# EAGLE design bristol_longshot (EAGLE 7.3.0)
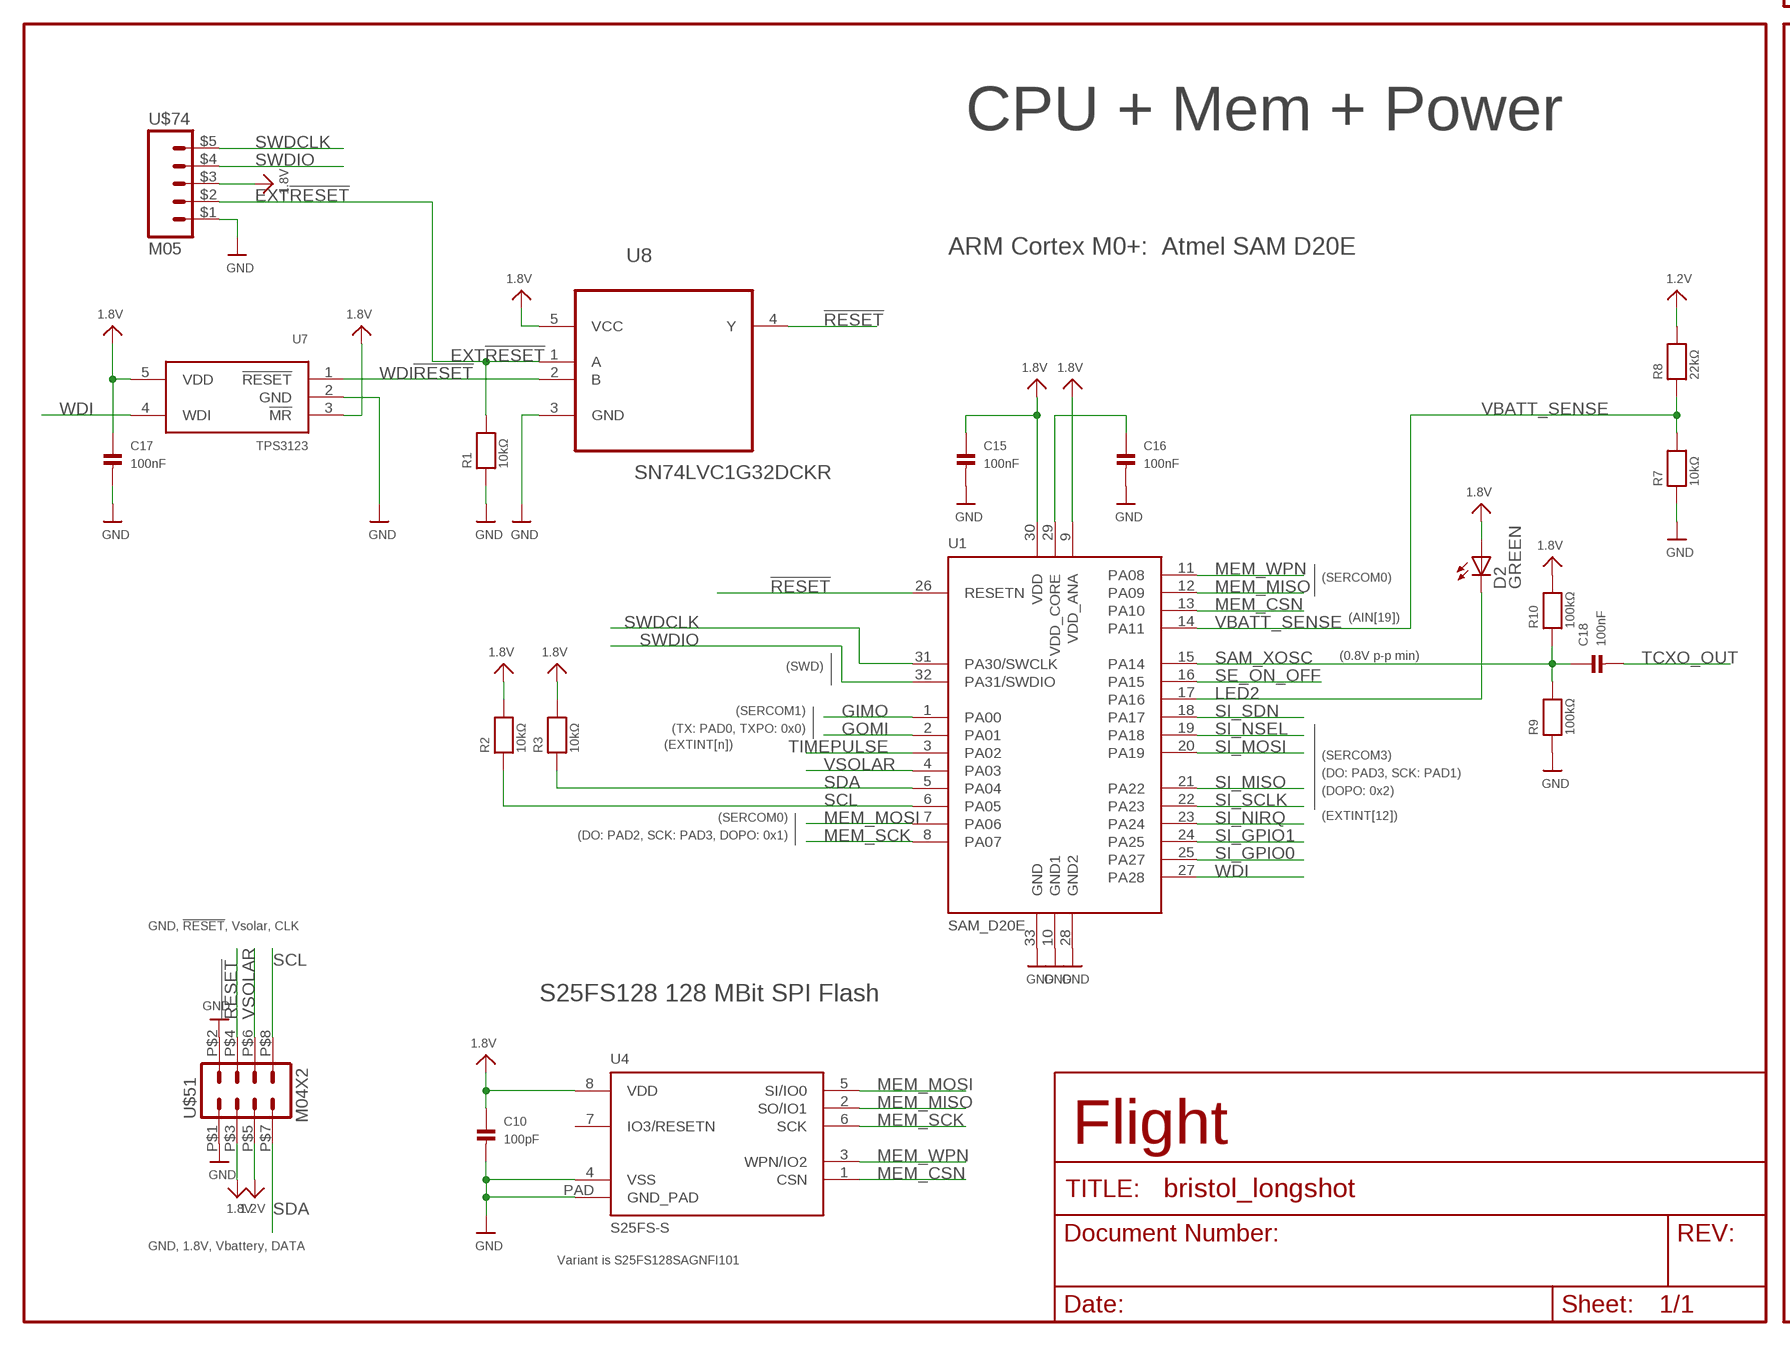
[diagram p0: schematic, sheet 1, part 1 of 2]
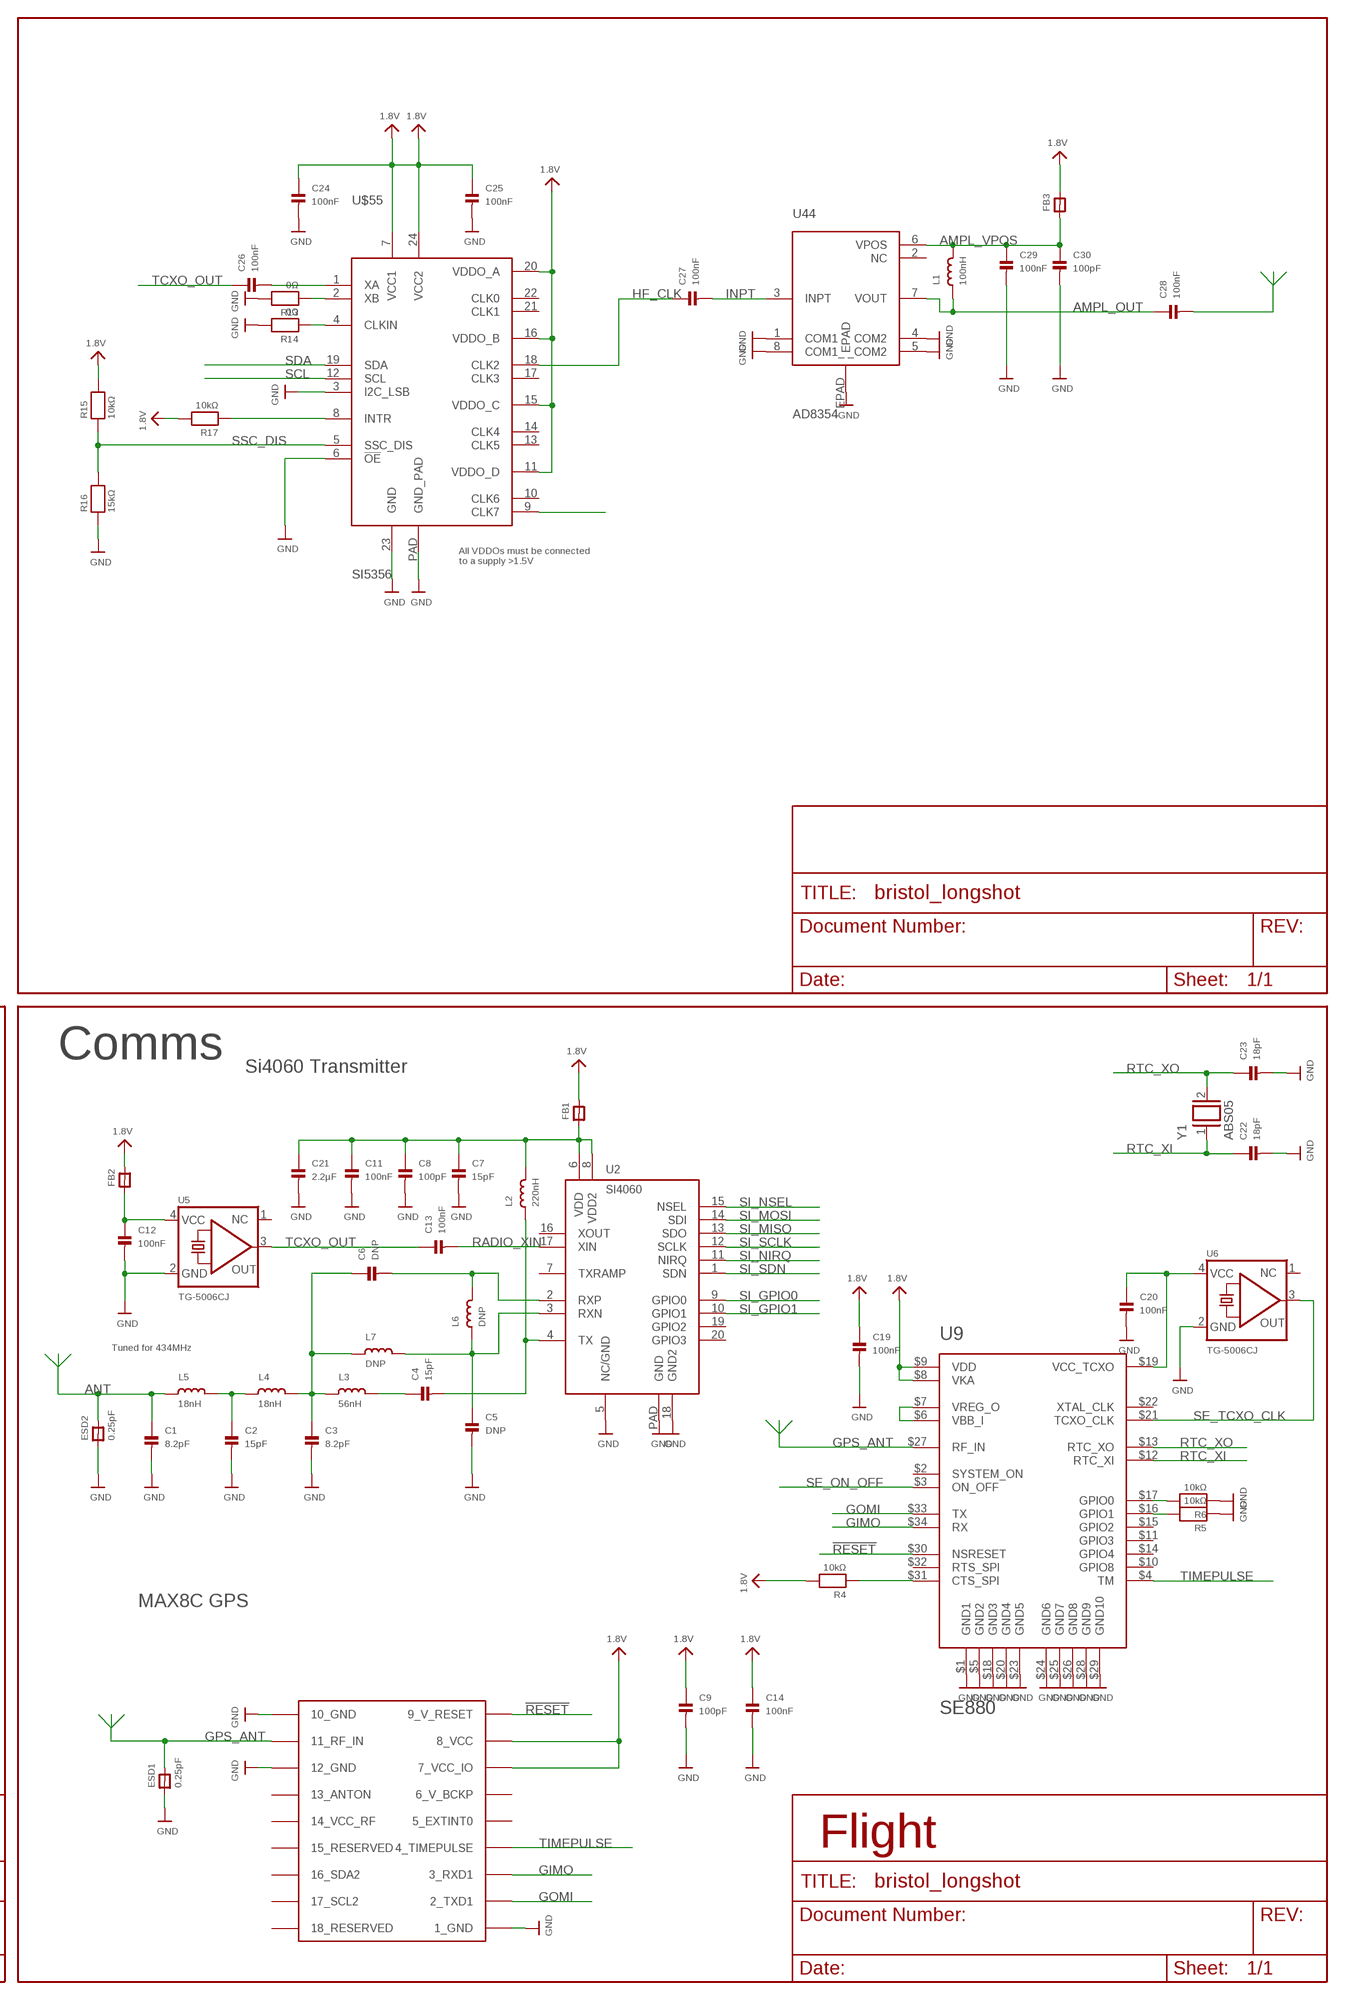
[diagram p1: schematic, sheet 1, part 2 of 2]

## Parts
C1  8.2pF  CAP_CERAMIC_0402  [_0402]
C2  15pF  CAP_CERAMIC_0402  [_0402]
C3  8.2pF  CAP_CERAMIC_0402  [_0402]
C4  15pF  CAP_CERAMIC_0402  [_0402]
C5  DNP  CAP_CERAMIC_0402  [_0402]
C6  DNP  CAP_CERAMIC_0402  [_0402]
C7  15pF  CAP_CERAMIC_0402  [_0402]
C8  100pF  CAP_CERAMIC_0402  [_0402]
C9  100pF  CAP_CERAMIC_0402  [_0402]
C10  100pF  CAP_CERAMIC_0402  [_0402]
C11  100nF  CAP_CERAMIC_0402  [_0402]
C12  100nF  CAP_CERAMIC_0402  [_0402]
C13  100nF  CAP_CERAMIC_0402  [_0402]
C14  100nF  CAP_CERAMIC_0402  [_0402]
C15  100nF  CAP_CERAMIC_0402  [_0402]
C16  100nF  CAP_CERAMIC_0402  [_0402]
C17  100nF  CAP_CERAMIC_0402  [_0402]
C18  100nF  CAP_CERAMIC_0402  [_0402]
C19  100nF  CAP_CERAMIC_0402  [_0402]
C20  100nF  CAP_CERAMIC_0402  [_0402]
C21  2.2µF  CAP_CERAMIC_0402  [_0402]
C22  18pF  CAP_CERAMIC_0402  [_0402]
C23  18pF  CAP_CERAMIC_0402  [_0402]
C24  100nF  CAP_CERAMIC_0402  [_0402]
C25  100nF  CAP_CERAMIC_0402  [_0402]
C26  100nF  CAP_CERAMIC_0402  [_0402]
C27  100nF  CAP_CERAMIC_0402  [_0402]
C28  100nF  CAP_CERAMIC_0402  [_0402]
C29  100nF  CAP_CERAMIC_0402  [_0402]
C30  100pF  CAP_CERAMIC_0402  [_0402]
D2  GREEN  LEDCHIPLED_0603  [CHIPLED_0603]
ESD1  0.25pF  FERRITE_0603MP  [_0603MP]
ESD2  0.25pF  FERRITE_0603MP  [_0603MP]
FB1  FERRITE_0402  [_0402]
FB2  FERRITE_0402  [_0402]
FB3  FERRITE_0402  [_0402]
L1  100nH  INDUCTOR_0402  [_0402]
L2  220nH  INDUCTOR_0402  [_0402]
L3  56nH  INDUCTOR_0402  [_0402]
L4  18nH  INDUCTOR_0402  [_0402]
L5  18nH  INDUCTOR_0402  [_0402]
L6  DNP  INDUCTOR_0402  [_0402]
L7  DNP  INDUCTOR_0402  [_0402]
R1  10kΩ  RESISTOR_0402  [_0402]
R2  10kΩ  RESISTOR_0402  [_0402]
R3  10kΩ  RESISTOR_0402  [_0402]
R4  10kΩ  RESISTOR_0402  [_0402]
R5  10kΩ  RESISTOR_0402  [_0402]
R6  10kΩ  RESISTOR_0402  [_0402]
R7  10kΩ  RESISTOR_0402  [_0402]
R8  22kΩ  RESISTOR_0402  [_0402]
R9  100kΩ  RESISTOR_0402  [_0402]
R10  100kΩ  RESISTOR_0402  [_0402]
R13  0Ω  RESISTOR_0402  [_0402]
R14  0Ω  RESISTOR_0402  [_0402]
R15  10kΩ  RESISTOR_0402  [_0402]
R16  15kΩ  RESISTOR_0402  [_0402]
R17  10kΩ  RESISTOR_0402  [_0402]
U1  SAM_D20E  [QFN32_5MM]
U2  SI4060  [QFN20]
U3  UBLOX_MAX  [UBLOX_MAX]
U4  S25FS-S  [WSON8]
U5  TG-5006CJ  [TC-5006CJ]
U6  TG-5006CJ  [TC-5006CJ]
U7  TPS3123  [SOT23-5]
U8  SN74LVC1G32DCKR  [SOT65P210X110-5N]
U9  SE880  [SE880]
U44  AD8354  [LFCSP_VD_8]
U$51  M04X2  [M04X2]
U$55  SI5356  [QFN24_4MM]
U$74  M05  [M05_SIDE]
Y1  ABS05  [ABS05]

## Nets
1.2V: R8.2 U$51.P$5
1.8V: C9.1 C10.1 C14.1 C15.1 C17.1 C19.1 C24.1 C25.1 D2.A FB1.2 FB2.2 FB3.2 R2.2 R3.2 R4.2 R10.2 R15.2 R17.2 U1.9(VDD_ANA) U1.30(VDD) U3.7_VCC_IO U3.8_VCC U4.8(VDD) U7.3(!MR) U7.5(VDD) U8.5(VCC) U9.$8(VKA) U9.$9(VDD) U$51.P$3 U$55.7(VCC1) U$55.11(VDDO_D) U$55.15(VDDO_C) U$55.16(VDDO_B) U$55.20(VDDO_A) U$55.24(VCC2) U$74.$3
!RESET: U1.26(RESETN) U3.9_V_RESET U8.4(Y) U9.$30(NSRESET) U$51.P$4
AMPL_OUT: C28.1 L1.1 U44.7(VOUT)
AMPL_VPOS: C29.1 C30.1 FB3.1 L1.2 U44.6(VPOS)
ANT: C1.1 ESD2.2 L5.1
CLKIN: R14.1 U$55.4(CLKIN)
EXT!RESET: R1.2 U8.1(A) U$74.$2
FILTER1: C3.1 C6.1 L3.1 L4.2 L7.1
FILTER2: C2.1 L4.1 L5.2
GIMO: U1.1(PA00) U3.3_RXD1 U9.$34(RX)
GND: C1.2 C2.2 C3.2 C5.2 C7.2 C8.2 C9.2 C10.2 C11.2 C12.2 C14.2 C15.2 C16.2 C17.2 C19.2 C20.2 C21.2 C22.2 C23.2 C24.2 C25.2 C29.2 C30.2 ESD1.1 ESD2.1 R1.1 R5.1 R6.1 R7.1 R9.1 R13.2 R14.2 R16.1 U1.10(GND1) U1.28(GND2) U1.33(GND) U2.5(NC/GND) U2.18(GND2) U2.PAD(GND) U3.1_GND U3.10_GND U3.12_GND U4.4(VSS) U4.PAD(GND_PAD) U5.2(GND) U6.2(GND) U7.2(GND) U8.3(GND) U9.$1(GND1) U9.$5(GND2) U9.$18(GND3) U9.$20(GND4) U9.$23(GND5) U9.$24(GND6) U9.$25(GND7) U9.$26(GND8) U9.$28(GND9) U9.$29(GND10) U44.1(COM1) U44.4(COM2) U44.5(_COM2) U44.8(COM1_) U44.EPAD U$51.P$1 U$51.P$2 U$55.3(I2C_LSB) U$55.6(!OE) U$55.23(GND) U$55.PAD(GND_PAD) U$74.$1
GOMI: U1.2(PA01) U3.2_TXD1 U9.$33(TX)
GPS_ANT: ESD1.2 U3.11_RF_IN U9.$27(RF_IN)
HF_ANT: C28.2
HF_CLK: C27.1 U$55.18(CLK2)
INPT: C27.2 U44.3(INPT)
INTR: R17.1 U$55.8(INTR)
LED2: D2.C U1.17(PA16)
MEM_CSN: U1.13(PA10) U4.1(CSN)
MEM_MISO: U1.12(PA09) U4.2(SO/IO1)
MEM_MOSI: U1.7(PA06) U4.5(SI/IO0)
MEM_SCK: U1.8(PA07) U4.6(SCK)
MEM_WPN: U1.11(PA08) U4.3(WPN/IO2)
N$2: U9.$6(VBB_I) U9.$7(VREG_O)
N$3: R6.2 U9.$17(GPIO0)
N$4: R4.1 U9.$31(CTS_SPI)
N$5: R5.2 U9.$16(GPIO1)
N$7: U$55.9(CLK7)
RADIO_VDD: C7.1 C8.1 C11.1 C21.1 FB1.1 L2.2 U2.6(VDD) U2.8(VDD2)
RADIO_XIN: C13.2 U2.17(XIN)
RF_OUT: C4.2 L2.1 U2.4(TX)
RTC_XI: C22.1 U9.$12(RTC_XI) Y1.1
RTC_XO: C23.1 U9.$13(RTC_XO) Y1.2
RXN: C5.1 L6.1 L7.2 U2.3(RXN)
RXP: C6.2 L6.2 U2.2(RXP)
SAM_XOSC: C18.1 R9.2 R10.1 U1.15(PA14)
SCL: R2.1 U1.6(PA05) U$51.P$8 U$55.12(SCL)
SDA: R3.1 U1.5(PA04) U$51.P$7 U$55.19(SDA)
SE_ON_OFF: U1.16(PA15) U9.$3(ON_OFF)
SE_TCXO_CLK: U6.3(OUT) U9.$21(TCXO_CLK)
SE_VCO_TCXO: C20.1 U6.4(VCC) U9.$19(VCC_TCXO)
SI_GPIO0: U1.25(PA27) U2.9(GPIO0)
SI_GPIO1: U1.24(PA25) U2.10(GPIO1)
SI_MISO: U1.21(PA22) U2.13(SDO)
SI_MOSI: U1.20(PA19) U2.14(SDI)
SI_NIRQ: U1.23(PA24) U2.11(NIRQ)
SI_NSEL: U1.19(PA18) U2.15(NSEL)
SI_SCLK: U1.22(PA23) U2.12(SCLK)
SI_SDN: U1.18(PA17) U2.1(SDN)
SSC_DIS: R15.1 R16.2 U$55.5(SSC_DIS)
SWDCLK: U1.31(PA30/SWCLK) U$74.$5
SWDIO: U1.32(PA31/SWDIO) U$74.$4
TANK: C4.1 L3.2
TCXO_OUT: C13.1 C18.2 C26.1 U5.3(OUT)
TCXO_VDD: C12.1 FB2.1 U5.4(VCC)
TIMEPULSE: U1.3(PA02) U3.4_TIMEPULSE U9.$4(TM)
VBATT_SENSE: R7.2 R8.1 U1.14(PA11)
VDD_CORE: C16.1 U1.29(VDD_CORE)
VSOLAR: U1.4(PA03) U$51.P$6
WDI: U1.27(PA28) U7.4(WDI)
WDI!RESET: U7.1(!RESET) U8.2(B)
XA: C26.2 U$55.1(XA)
XB: R13.1 U$55.2(XB)
Unconnected: U2.7(TXRAMP) U2.16(XOUT) U2.19(GPIO2) U2.20(GPIO3) U3.5_EXTINT0 U3.6_V_BCKP U3.13_ANTON U3.14_VCC_RF U3.15_RESERVED U3.16_SDA2 U3.17_SCL2 U3.18_RESERVED U4.7(IO3/RESETN) U5.1(NC) U6.1(NC) U9.$2(SYSTEM_ON) U9.$10(GPIO8) U9.$11(GPIO3) U9.$14(GPIO4) U9.$15(GPIO2) U9.$22(XTAL_CLK) U9.$32(RTS_SPI) U44.2(NC) U$55.10(CLK6) U$55.13(CLK5) U$55.14(CLK4) U$55.17(CLK3) U$55.21(CLK1) U$55.22(CLK0)

## Notes on the sheet
- All VDDOs must be connected
  to a supply >1.5V
- Comms
- Si4060 Transmitter
- CPU + Mem + Power
- ARM Cortex M0+:  Atmel SAM D20E
- Tuned for 434MHz
- (SERCOM0)
- (AIN[19])
- (0.8V p-p min)
- (SWD)
- (SERCOM1)
- (TX: PAD0, TXPO: 0x0)
- (EXTINT[n])
- (SERCOM3)
- (DO: PAD3, SCK: PAD1)
- (DOPO: 0x2)
- (SERCOM0) | (EXTINT[12]) | MAX8C GPS
- (DO: PAD2, SCK: PAD3, DOPO: 0x1)
- GND, !RESET!, Vsolar, CLK
- S25FS128 128 MBit SPI Flash
- Flight | Flight
- GND, 1.8V, Vbattery, DATA
- Variant is S25FS128SAGNFI101

## Library data of the parts
C1-C30 = microbuilder_v3:CAP_CERAMIC: Ceramic Capacitors 0402 - 0402 Surface Mount Capacitors 16pF 50V 5% [Digikey: 445-4899-2-ND] 18pF 50V 5% [Digikey: 490-1281-2-ND] 22pF 50V 5% [Digikey: 490-1283-2-ND] 68pF 50V 5% [Digikey: 490-1289-2-ND] 0.1uF 10V 10% [Digikey: 490-1318-2-ND] 1.0uF 6.3V 10% [Digikey: 490-1320-2-ND] 0603 - 0603 Surface Mount Capacitors 16 pF 50V 5% [Digikey: 445-5051-2-ND] 22 pF 50V [Digikey: PCC220ACVTR-ND] 33 pF 50V 5% [Digikey: 490-1415-1-ND] 56pF 50V 5% [Digikey: 490-1421-1-ND] 220pF 50V 5% [Digikey: 445-1285-1-ND] 680 pF 50V 2200 pF 50V 5% C0G [Digikey: 445-1297-1-ND] 5600 pF 100V 5% X7R [Digikey: 478-3711-1-ND] 0.1 µF 25V 10% [Digikey: PCC2277TR-ND] 0.22 µF 16V 10% X7R [Digikey: 445-1318-1-ND] 1.0 µF 25V 10% [Digikey: 445-5146-2-ND] 0603 - RF Specific 3pF 250V +/-0.1pF RF [Digikey: 712-1347-1-ND] 18 pF 250V 5% [Digikey: 478-3505-1-ND or 712-1322-1-ND] 56 pF 250V 5% C0G RF [Digikey: 490-4867-1-ND] 68 pF 250V RF [Digikey: 490-4868-1-ND] 0805 - 0805 Surface Mount Capacitors 220 pF 250V 2% RF Ceramic Capacitor [Digikey: 712-1398-1-ND] 1000 pF 50V 2% NP0 Ceramic Capacitor [Digikey: 478-3760-1-ND] 0.1 µF 25V 10% Ceramic Capacitor [Digikey: PCC1828TR-ND] 1.0 µF 16V 10% Ceramic Capacitor[Digikey: 490-1691-2-ND] 10.0 µF 10V 10% Ceramic Capacitor[Digikey: 709-1228-1-ND] 10.0 uF 16V 10% Ceramic Capacitor [Digikey: 478-5165-2-ND] 47 uF 6.3V 20% Ceramic Capacitor [Digikey: 587-1779-1-ND or 399-5506-1-ND] 1206 - 1206 Surface Mount Capacitors 47uF 10V 20% Ceramic Capacitor [Digikey: 490-5528-1-ND or 399-5508-1-ND or 445-6010-1-ND] 100uF 6.3V -20%, +80% Y5V Ceramic Capacitor (Digikey: 490-4512-1-ND, Mouser: 81-GRM31CF50J107ZE1L)
D2 = led:LED: LED OSRAM: - CHIPLED LG R971, LG N971, LY N971, LG Q971, LY Q971, LO R971, LY R971 LH N974, LH R974 LS Q976, LO Q976, LY Q976 LO Q996 - Hyper CHIPLED LW Q18S LB Q993, LB Q99A, LB R99A - SideLED LS A670, LO A670, LY A670, LG A670, LP A670 LB A673, LV A673, LT A673, LW A673 LH A674 LY A675 LS A676, LA A676, LO A676, LY A676, LW A676 LS A679, LY A679, LG A679 - Hyper Micro SIDELED® LS Y876, LA Y876, LO Y876, LY Y876 LT Y87S - SmartLED LW L88C, LW L88S LB L89C, LB L89S, LG L890 LS L89K, LO L89K, LY L89K LS L896, LA L896, LO L896, LY L896 - TOPLED LS T670, LO T670, LY T670, LG T670, LP T670 LSG T670, LSP T670, LSY T670, LOP T670, LYG T670 LG T671, LOG T671, LSG T671 LB T673, LV T673, LT T673, LW T673 LH T674 LS T676, LA T676, LO T676, LY T676, LB T676, LH T676, LSB T676, LW T676 LB T67C, LV T67C, LT T67C, LS T67K, LO T67K, LY T67K, LW E67C LS E67B, LA E67B, LO E67B, LY E67B, LB E67C, LV E67C, LT E67C LW T67C LS T679, LY T679, LG T679 LS T770, LO T770, LY T770, LG T770, LP T770 LB T773, LV T773, LT T773, LW T773 LH T774 LS E675, LA E675, LY E675, LS T675 LS T776, LA T776, LO T776, LY T776, LB T776 LHGB T686 LT T68C, LB T68C - Hyper Mini TOPLED® LB M676 - Mini TOPLED Santana® LG M470 LS M47K, LO M47K, LY M47K Source: http://www.osram.convergy.de LUXEON: - LUMILED® LXK2-PW12-R00, LXK2-PW12-S00, LXK2-PW14-U00, LXK2-PW14-V00 LXK2-PM12-R00, LXK2-PM12-S00, LXK2-PM14-U00 LXK2-PE12-Q00, LXK2-PE12-R00, LXK2-PE12-S00, LXK2-PE14-T00, LXK2-PE14-U00 LXK2-PB12-K00, LXK2-PB12-L00, LXK2-PB12-M00, LXK2-PB14-N00, LXK2-PB14-P00, LXK2-PB14-Q00 LXK2-PR12-L00, LXK2-PR12-M00, LXK2-PR14-Q00, LXK2-PR14-R00 LXK2-PD12-Q00, LXK2-PD12-R00, LXK2-PD12-S00 LXK2-PH12-R00, LXK2-PH12-S00 LXK2-PL12-P00, LXK2-PL12-Q00, LXK2-PL12-R00 Source: www.luxeon.com KINGBRIGHT: KA-3528ASYC Source: www.kingbright.com
ESD1 ESD2 FB1-FB3 = microbuilder_v3:FERRITE: Ferrite Bead 0603 MMZ1608B121C - 120 Ohm @ 100MHz, 600mA, 0.15 Ohm DC Resistance - Digikey: 445-2164-1-ND BK1608HW121-T - 120 Ohm, 600mA Ferrite Chip - Digikey: 587-1876-2-ND 0805 HZ0805B272R-10 - 2.7K Ohm @ 100MHz, 200mA, 0.8 Ohm DC Resistance - Digikey: 240-2504-1-ND (see also Murata BLM21BD272SN1L) MMZ2012Y152B - 1.5K Ohm @ 100MHz, 500mA, 0.4 Ohm DC Resistance - Digikey: 445-1560-1-ND - Mainly for high frequency (80-400MHz) MMZ2012R102A - 1K Ohm @ 100MHz, 500mA, 0.3 Ohm DC Resistance - Digikey: 445-1555-2-ND - More general purpose (10-200MHz)
L1-L7 = microbuilder_v3:INDUCTOR: Inductors 0603: 10nH Ceramic Inductor - microwire antenna/RF (Digikey: 712-1434-2-ND) 0805: 560nH Ceramic Inductor - RF (Digikey: 553-1047-1-ND) 270nH Ceramic Inductor - Q = 40@250MHz, +-5%, 1 Ohm DC Resistance (Digikey: 535-10506-2-ND) 1007 (2518 Metric) SMT: 10µH 10% 250mOhm 820mA 1007 Inductor (Digikey: 587-2189-1-ND) 22µH 10% 500mOhm 580mA 1007 Inductor (Digikey: 587-2190-1-ND) 47µH 10% 950mOhm 420mA 1007 Inductor (Digikey: 587-2191-1-ND) 47µH 5% 100mOhm 1A 1008 Inductor (Digikey: 732-1816-1-ND) 5.0x5.0mm (Taiyo Yuden NR5040 Series) 6.8µH 20% 2.3A 64mOhm Inductor (Digikey: 587-2374-2-ND) 5.0x5.0mm (TDK VLC5045 Series) 4.7µH 20% 3.3A 34mOhm Inductor (Digikey: 445-6526-1-ND) 6.8µH 20% 2.7A 46mOhm Inductor (Digikey: 445-6527-1-ND) 6.0x6.0mm (TDK VLC6045 Series) 4.7µH 20% 3.8A 27mOhm Inductor (Digikey: 445-6538-2-ND) 6.8µH 20% 3A 41mOhm Inductor (Digikey: 445-6540-1-ND) 6.2µH 30% 2.2A 45mOhm Inductor (Digikey: SRR5028-6R2YCT-ND) - Not TDK VLC6045 but footprint should match 6.0x6.0mm (TDK SLF6045 Series) 6.8uH 30% 2A 33mOhm Inductor (Digikey: 445-4572-1-ND, Mouser: 810-SLF645T6R8N2R0PF)
R1-R10 R13-R17 = microbuilder_v3:RESISTOR: Resistors 0402 - 0402 Surface Mount Package 22 Ohm 1% 1/16W [Digikey: 311-22.0LRTR-ND] 33 Ohm 5% 1/16W 1.0K 5% 1/16W 1.5K 5% 1/16W 2.0K 1% 1/16W 10.0K 1% 1/16W [Digikey: 311-10.0KLRTR-ND] 10.0K 5% 1/16W [Digikey: RMCF0402JT10K0TR-ND] 12.1K 1% 1/16W [Digikey: 311-22.0LRTR-ND] 100.0K 5% 1/16W 0603 - 0603 Surface Mount Package 0 Ohm 1/10 Watt 1% Resistor 15 Ohm 1/10 Watt 1% Resistor 33 Ohm 1/10 Watt 1% Resistor 49.9 Ohm 1/10 Watt 1% Resistor 100 Ohm 1/10 Watt 1% Resistor 150 Ohm 1/10 Watt 1% Resistor 240 Ohm 1/10 Watt 1% Resistor 390 Ohm 1/10 Watt 1% Resistor 560 Ohm 1/10 Watt 1% Resistor 680 Ohm 1/10 Watt 1% Resistor 750 Ohm 1/10 Watt 1% Resistor 1.0K Ohm 1/10 Watt 1% Resistor 1.5K Ohm 1/10 Watt 1% Resistor 2.0K Ohm 1/10 Watt 1% Resistor 2.2K Ohm 1/10 Watt 1% Resistor 3.3K Ohm 1/10 Watt 1% Resistor 4.7K Ohm 1/10 Watt 1% Resistor 10.0K Ohm 1/10 Watt 1% Resistor 12.0K Ohm 1/10 Watt 1% Resistor 12.1K Ohm 1/10 Watt 1% Resistor 20.0K Ohm 1/10 Watt 1% Resistor 33.0K Ohm 1/10 Watt 1% Resistor 100.0K Ohm 1/10 Watt 1% Resistor 0805 - 0805 Surface Mount Package 0 Ohm 1/8 Watt 1% Resistor 33 Ohm 1/8 Watt 1% Resistor 100 Ohm 1/8 Watt 1% Resistor 150 Ohm 1/8 Watt 1% Resistor 200 Ohm 1/8 Watt 1% Resistor 240 Ohm 1/8 Watt 1% Resistor 330 Ohm 1/8 Watt 1% Resistor 390 Ohm 1/8 Watt 1% Resistor 470 Ohm 1/8 Watt 1% Resistor 1.0K Ohm 1/8 Watt 1% Resistor 1.5K Ohm 1/8 Watt 1% Resistor 2.0K Ohm 1/8 Watt 1% Resistor 4.7K Ohm 1/8 Watt 1% Resistor 5.1K Ohm 1/8 Watt 1% Resistor 5.6K Ohm 1/8 Watt 1% Resistor 10.0K Ohm 1/8 Watt 1% Resistor 22.0K Ohm 1/8 Watt 1% Resistor 33.0K Ohm 1/8 Watt 1% Resistor 100K Ohm 1/8 Watt 1% Resistor 1206 - 1206 Surface Mount Package 2012 - 2010 Surface Mount Package 0.11 Ohm 1/2 Watt 1% Resistor - Digikey: RHM.11UCT-ND
U1 = fbri:SAM_D20E
U2 = fbri:SI4060
U3 = Ava:UBLOX_MAX: UBLOX MAX
U4 = fbri:S25FS-S
U5 U6 = fbri:TG-5006CJ
U7 = TPS3125:TPS3123
U8 = SN74LVC1G32DCKR:SN74LVC1G32DCKR: 2-INPUT POSITIVE-OR GATE; MPN: SN74LVC1G32DCKR; OC_FARNELL: 1470880; OC_NEWARK: 76C4094; PACKAGE: SC-70-5; SUPPLIER: Texas Instruments
U9 = fbri:SE880
U44 = fbri:AD8354
U$51 = fbri:M04X2
U$55 = si5356:SI5356
U$74 = fbri:M05
Y1 = fbri:ABS05

## Board
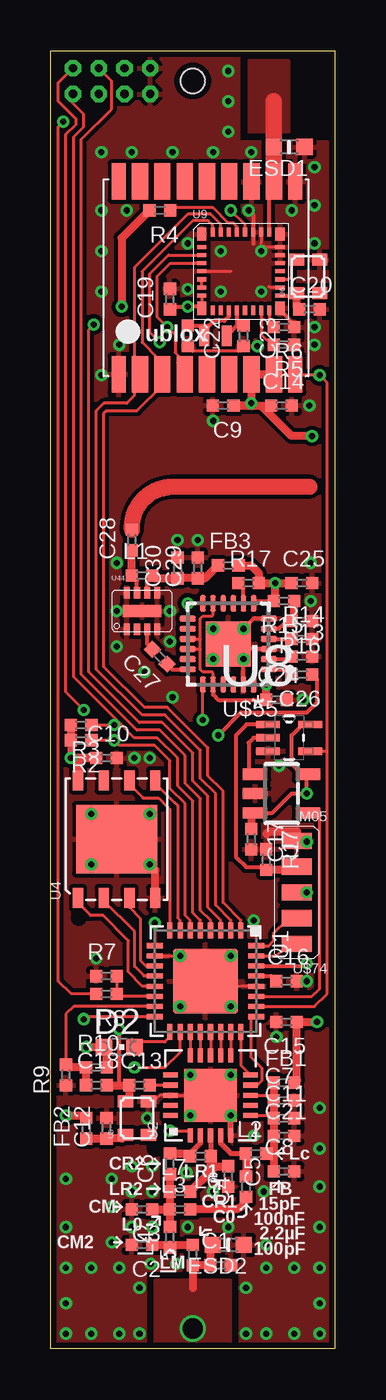
[diagram p2: board, top side]
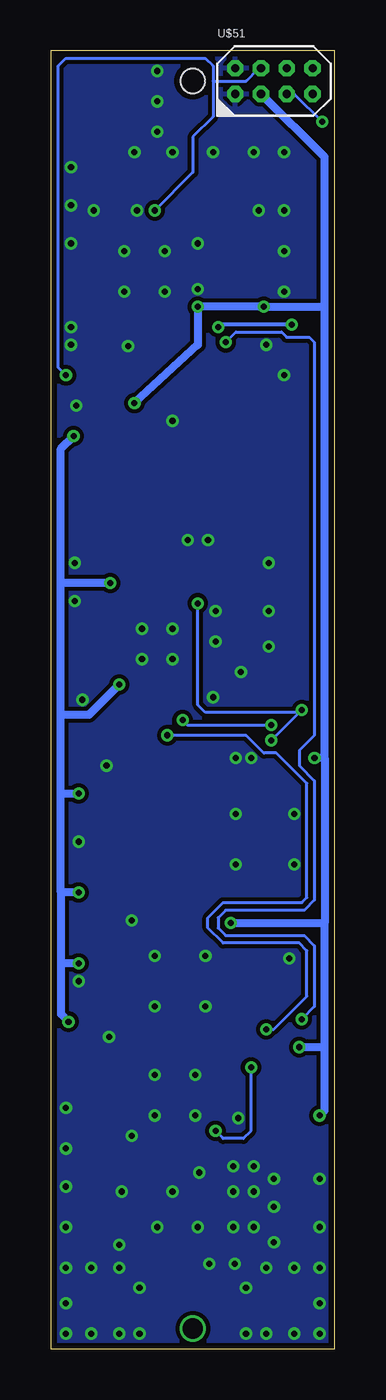
[diagram p3: board, bottom side, seen from below]

Size 14 x 64 mm. Coordinates in mm from the lower left corner, seen from the top.
Outline: 0,0 0,64 14,64 14,0 0,0
Copper layers (1*16): Top 0.035mm / dielectric 1.5mm / Bottom 0.035mm
Design rules "PCB-POOL Standard *": minimum track width 0.15mm, minimum drill 0.3mm, track to track 0.15mm, track to pad 0.15mm, pad to pad 0.15mm, via to via 0.15mm, smd to smd 0.15mm, copper to edge 0.3mm, drill to drill 0.2mm, minimum pad ring 0.2mm, minimum via ring 0.15mm, stop-mask expansion 0.075mm, vias tented up to drill 0.3mm, thermal gap 0.2mm
Holes 1.2 mm at 7,62.5
tRestrict: area 1.3,21.1 to 1.5,21.4; area 6.3,10.2 to 6.5,10.3; area 5,9.8 to 5.2,10

### Footprints (pad centres in the part's own frame; a part is rotated, then mirrored left to right if it is on the bottom)
_0402 = smd 0.6 x 0.6: 1 -0.508,0; 2 0.508,0
CHIPLED_0603 = smd 0.8 x 0.8: A 0,-0.75; C 0,0.75
_0603MP = smd 0.8 x 0.8: 1 -0.762,0; 2 0.762,0
QFN32_5MM = smd 0.8 x 0.25: 1 -2.5,1.75; 2 -2.5,1.25; 3 -2.5,0.75; 4 -2.5,0.25; 5 -2.5,-0.25; 6 -2.5,-0.75; 7 -2.5,-1.25; 8 -2.5,-1.75; 17 2.5,-1.75; 18 2.5,-1.25; 19 2.5,-0.75; 20 2.5,-0.25; 21 2.5,0.25; 22 2.5,0.75; 23 2.5,1.25; 24 2.5,1.75 | smd 0.25 x 0.8: 9 -1.75,-2.5; 10 -1.25,-2.5; 11 -0.75,-2.5; 12 -0.25,-2.5; 13 0.25,-2.5; 14 0.75,-2.5; 15 1.25,-2.5; 16 1.75,-2.5; 25 1.75,2.5; 26 1.25,2.5; 27 0.75,2.5; 28 0.25,2.5; 29 -0.25,2.5; 30 -0.75,2.5; 31 -1.25,2.5; 32 -1.75,2.5 | smd 3.2 x 3.2: 33 0,0
QFN20 = smd 0.7 x 0.25: 1 -1.97,1; 2 -1.97,0.5; 3 -1.97,0; 4 -1.97,-0.5; 5 -1.97,-1; 11 1.97,-1; 12 1.97,-0.5; 13 1.97,0; 14 1.97,0.5; 15 1.97,1 | smd 0.25 x 0.7: 6 -1,-1.97; 7 -0.5,-1.97; 8 0,-1.97; 9 0.5,-1.97; 10 1,-1.97; 16 1,1.97; 17 0.5,1.97; 18 0,1.97; 19 -0.5,1.97; 20 -1,1.97 | smd 2.6 x 2.6: PAD 0,0
UBLOX_MAX = smd 1.8 x 0.7: 1_GND 4.95,-4.4; 9_V_RESET 4.95,4.3; 10_GND -4.55,4.3; 18_RESERVED -4.55,-4.4 | smd 1.8 x 0.8: 2_TXD1 4.95,-3.35; 3_RXD1 4.95,-2.25; 4_TIMEPULSE 4.95,-1.15; 5_EXTINT0 4.95,-0.05; 6_V_BCKP 4.95,1.05; 7_VCC_IO 4.95,2.15; 8_VCC 4.95,3.25; 11_RF_IN -4.55,3.25; 12_GND -4.55,2.15; 13_ANTON -4.55,1.05; 14_VCC_RF -4.55,-0.05; 15_RESERVED -4.55,-1.15; 16_SDA2 -4.55,-2.25; 17_SCL2 -4.55,-3.35
WSON8 = smd 1 x 0.5: 1 -2.9,1.905; 2 -2.9,0.635; 3 -2.9,-0.635; 4 -2.9,-1.905; 5 2.9,-1.905; 6 2.9,-0.635; 7 2.9,0.635; 8 2.9,1.905 | smd 3.4 x 4: PAD 0,0
TC-5006CJ = smd 0.6 x 0.75: 1 -0.825,-0.565; 2 0.825,-0.565; 3 0.825,0.565; 4 -0.825,0.565
SOT23-5 = smd 0.55 x 1.2: 1 -0.95,-1.3; 2 0,-1.3; 3 0.95,-1.3; 4 0.95,1.3; 5 -0.95,1.3
SOT65P210X110-5N = smd 1.168 x 0.356: 1 -1.041,0.66; 2 -1.041,0; 3 -1.041,-0.66; 4 1.041,-0.66; 5 1.041,0.66
SE880 = smd 0.45 x 0.65: $1 -1.925,1.825; $9 -1.925,-1.825; $18 1.925,-1.825; $26 1.925,1.825 | smd 0.45 x 0.2: $2 -1.925,1.2; $3 -1.925,0.8; $4 -1.925,0.4; $5 -1.925,0; $6 -1.925,-0.4; $7 -1.925,-0.8; $8 -1.925,-1.2; $19 1.925,-1.2; $20 1.925,-0.8; $21 1.925,-0.4; $22 1.925,0; $23 1.925,0.4; $24 1.925,0.8; $25 1.925,1.2 | smd 0.2 x 0.45: $10 -1.4,-1.925; $11 -1,-1.925; $12 -0.6,-1.925; $13 -0.2,-1.925; $14 0.2,-1.925; $15 0.6,-1.925; $16 1,-1.925; $17 1.4,-1.925; $27 1.4,1.925; $28 1,1.925; $29 0.6,1.925; $30 0.2,1.925; $31 -0.2,1.925; $32 -0.6,1.925; $33 -1,1.925; $34 -1.4,1.925
LFCSP_VD_8 = smd 0.3 x 0.55: 1 -0.75,-0.9; 2 -0.25,-0.9; 3 0.25,-0.9; 4 0.75,-0.9; 5 0.75,0.9; 6 0.25,0.9; 7 -0.25,0.9; 8 -0.75,0.9 | smd 1.89 x 0.6: EPAD 0,0
M04X2 = drill 0.4 octagon: P$1 -1.905,-0.635; P$2 -1.905,0.635; P$3 -0.635,-0.635; P$4 -0.635,0.635; P$5 0.635,-0.635; P$6 0.635,0.635; P$7 1.905,-0.635; P$8 1.905,0.635
QFN24_4MM = smd 0.8 x 0.28: 1 -2,1.25; 2 -2,0.75; 3 -2,0.25; 4 -2,-0.25; 5 -2,-0.75; 6 -2,-1.25; 13 2,-1.25; 14 2,-0.75; 15 2,-0.25; 16 2,0.25; 17 2,0.75; 18 2,1.25 | smd 0.28 x 0.8: 7 -1.25,-2; 8 -0.75,-2; 9 -0.25,-2; 10 0.25,-2; 11 0.75,-2; 12 1.25,-2; 19 1.25,2; 20 0.75,2; 21 0.25,2; 22 -0.25,2; 23 -0.75,2; 24 -1.25,2 | smd 2.2 x 2.2: PAD 0,0
M05_SIDE = smd 1.5 x 0.8: $1 0,-2.54; $2 0,-1.27; $3 0,0; $4 0,1.27; $5 0,2.54
ABS05 = smd 0.5 x 1: 1 0.55,0; 2 -0.55,0

### Placement (x,y rotation side)
C1  8.38,4.12 0 top
C2  4.5,5.12 180 top
C3  4.5,6.88 180 top
C4  9.62,8 90 top
C5  8.75,8.5 270 top
C6  5.88,9.12 90 top
C7  11.5,12.25 0 top
C8  11.5,8.75 0 top
C9  8.5,46.5 180 top
C10  2.75,29.12 0 top
C11  11.5,11.38 0 top
C12  2.75,10.88 90 top
C13  4.38,13 0 top
C14  11.38,46.5 0 top
C15  11.62,16.12 180 top
C16  11.62,18.12 0 top
C17  9.88,25.12 270 top
C18  2.25,13 0 top
C19  5.88,51.75 90 top
C20  12.75,51.25 0 top
C21  11.5,10.5 0 top
C22  6.75,49.94 270 top
C23  9.5,49.94 270 top
C24  11.12,32 0 top
C25  12.38,37.75 0 top
C26  12.38,33.25 180 top
C27  5.38,34.12 135 top
C28  4,39.88 90 top
C29  7.25,38.5 90 top
C30  6.25,38.5 90 top
D2  3.38,14.88 270 top
ESD1  11.75,59.25 180 top
ESD2  8.75,5.12 180 top
FB1  11.5,13.12 0 top
FB2  1.75,10.88 90 top
FB3  8.75,38.62 0 top
L1  4.5,38.12 0 top
L2  10.12,9.62 0 top
L3  6.38,6.88 0 top
L4  5.88,5.5 90 top
L5  7,4.62 90 top
L6  7.38,9.5 180 top
L7  6.38,7.75 0 top
R1  10.62,24.12 270 top
R2  1.5,30 180 top
R3  1.5,30.75 180 top
R4  5.38,56.12 180 top
R5  11.5,49.5 180 top
R6  11.5,50.38 180 top
R7  2.75,18.38 0 top
R8  2.75,17.5 180 top
R9  0.75,13.5 90 top
R10  2.25,13.88 0 top
R13  12.38,34.12 0 top
R14  12.38,35 0 top
R15  11.5,36.88 180 top
R16  12.38,35.88 180 top
R17  9.75,37.75 0 top
U1  7.62,18.12 270 top
U2  7.88,12.5 90 top
U3  7.75,53 270 top
U4  3.25,25.12 90 top
U5  4.25,11.38 90 top
U6  12.69,52.88 90 top
U7  11.38,27.38 270 top
U8  11.75,30.12 0 top
U9  9.38,53.12 0 top
U44  4.5,36.38 0 top
U$51  3,62.5 0 bottom
U$55  8.75,34.75 180 top
U$74  12.12,22.5 180 top
Y1  8.12,49.94 180 top

### Tracks (layer width: path | path; a pad name or v marks a point on that pad's centre or on a via)
1.2V  (via drill 0.3)
  Top 0.15: v0.62,60.5 0.38,60.25 0.38,18.12 1,17.5 R8.2
  Bottom 0.15: U$51.P$5 1.99,61.87 v0.62,60.5
1.8V  (via drill 0.3)
  Top 0.15: U9.$8 U9.$9 | U$55.20 8,33.31 7.94,33.38 7.5,33.38 7.38,33.5 7.38,34.5 | 7.38,34.5 7.38,35 | 7.38,35 7.38,36 7.5,36.12 7.94,36.12 8,36.19 U$55.11 | U$55.15 7.38,35 | U$55.16 7.38,34.5
  Top 0.152: 1.34,27.72 U4.8 | 5.09,19.84 U1.9 v5.12,21
  Top 0.2: U9.$9 7.38,51.38 v6.75,51.38 5.76,51.38 C19.1 | U1.30 12.5,18.88 v12.62,19 | U8.5 12.41,30.79 11.88,30.25 11.88,28.82 12.38,28.32 U7.5 12.62,28.27 v12.62,27.38 11.88,27.38 10.93,26.43 U7.3 | U$55.7 10,36.88 R15.2 | U$55.20 8,32.25 8.25,32 C24.1 10,32 | U$55.24 v10.62,32.75
  Top 0.4: U3.7_VCC_IO 9.88,48.02 v9.88,46.62 9.75,46.5 C9.1 10.38,46.5 | R10.2 2.76,14.62 D2.A v1.75,14.88 | v0.75,11.5 1.75,11.5 FB2.2 | 10.38,46.5 C14.1 | R4.2 3.5,54.76 v3.5,51.38 | v13.12,16.12 C15.1 12.13,13.25 FB1.2 | R3.2 R2.2 v1,29.12 C10.1 1.38,29.12 1.38,28.05 | U7.3 9.88,26.23 C17.1 | v11.06,37.75 R17.2 10.25,38.25 9.88,38.62 FB3.2 | v11.06,37.75 C25.1 | R15.2 11.06,36.94 v11.06,37.75 | C24.1 v10.62,32.74 v10.62,32.75 | v12.88,45 11.88,45 10.38,46.5
  Top 0.406: U3.7_VCC_IO U3.8_VCC | U4.8 1.38,28.05 | U$74.$3 v12.62,22.5
  Bottom 0.4: 0.5,29.12 0.5,21 | v5.12,21 0.5,21 | v9.88,46.62 6.75,49.5 v6.75,51.38 v3.5,51.38 0.5,51.38 | v0.75,11.5 0.5,11.75 0.5,14.88 | 0.5,14.88 0.5,21 | v1.75,14.88 0.5,14.88 | 0.5,29.12 v1,29.12 | v12.62,19 13.5,19 | 13.5,19 13.5,16.5 v13.12,16.12 | v12.62,22.5 13.5,22.5 | 13.5,22.5 13.5,19 | 13.5,22.5 13.5,27.38 | 13.5,27.38 v12.62,27.38 | 13.5,27.38 13.5,31.25 | 13.5,31.25 13.5,37.75 | 13.5,37.75 13.5,44.38 v12.88,45 | 0.5,29.12 0.5,51.38 | 0.5,51.38 0.5,58.75 3.62,61.87 U$51.P$3 | 13.5,31.25 12.12,31.25 v10.62,32.75 | v11.06,37.75 13.5,37.75
!RESET  (via drill 0.3)
  Top 0.15: U9.$30 9.57,55.42 v8.88,56.12 | U1.26 13,16.88 13.62,17.5 13.62,29.46 | U8.4 13.62,29.46 | 13.62,29.46 13.62,47.62 v13.25,48 12.1,48 U3.9_V_RESET
  Bottom 0.15: v13.25,48 13.62,48.38 13.62,63.25 13.25,63.62 6.38,63.62 6,63.25 6,62.5 | v8.88,56.12 7,58 7,59.75 6,60.75 6,62.5 | 6,62.5 4.38,62.5 3.74,63.13 U$51.P$4
AMPL_OUT
  Top 0.2: U44.7 4.25,37.87 L1.1
  Top 0.4: L1.1 3.99,39.48 C28.1
AMPL_VPOS
  Top 0.2: U44.6 4.75,37.87 L1.2
  Top 0.4: L1.2 5.14,37.99 C30.1 C29.1 7.61,37.99 FB3.1
ANT  (via drill 1)
  Top 0.406: 7,3 L5.1 C1.1 7.87,5 ESD2.2
  other vias: 7,1
  pour Top: 5.12,0 8.88,0 8.88,3.38 5.12,3.38
CLKIN
  Top 0.2: U$55.4 R14.1
EXT!RESET
  Top 0.2: U8.1 9.66,30.79 9.12,30.25 9.12,24.25 9.62,23.75 10.49,23.75 R1.2
  Top 0.4: U$74.$2 11.97,23.62 R1.2
FILTER1
  Top 0.406: C6.1 5.87,8.62 L7.1 L3.1 | L3.1 5.88,7 L4.2 | C3.1 L3.1
FILTER2
  Top 0.406: C2.1 5.02,5.13 5.88,5.13 | 5.88,5.13 L5.2 | L4.1 5.88,5.13
GIMO
  Top 0.15: U9.$34 7.97,55.4 7.75,55.62 7,55.62 4.5,53.12 4.5,49.62 5.25,48.88 5.25,48.5 U3.3_RXD1 5.5,47.5 4.25,46.25 2.75,46.25 2.62,46.12 2.62,33.62 4.62,31.62 5.75,31.62 7.75,29.62 7.75,28.25 8.5,27.5 8.5,22 9.38,21.12 U1.1
GND  (via drill 0.3)
  Top 0.15: U9.$28 10.38,54.5 | U9.$25 10.55,54.33 10.5,54.38 | U9.$20 10.8,52.33 10.75,52.38 | U9.$5 8.88,53.12 | C23.2 9.26,49.19 6.99,49.19 C22.2
  Top 0.152: U1.10 v6.38,19.38 U1.33 7.62,19.38 v8.88,19.38 | 6.88,12.25 6.62,12.5 U2.18 5.38,12.5 5.12,12.25 4.87,12.25 U5.2 | U4.PAD v2,23.88 | U1.28 9,17.88 9,17 v8.88,16.88 | U2.PAD v8.88,13.5
  Top 0.2: 10,54.5 10,55.88 | 11.32,51.3 11.38,51.12 12.01,50.49 R6.1 | U$55.3 9.5,34.5 | U$55.6 10,36 v9.5,35.5 U$55.PAD 9,34.5 9.5,34.5 | U$55.23 v9.5,34 9.5,34.5
  Top 0.305: 6.88,12.25 v6.88,11.5 | U2.5 v8.88,11.5
  Top 0.4: 10.63,25.38 10.75,25.5 12.13,25.51 | 12.13,25.51 12.12,25 | U$74.$1 12.1,25.04 12.13,25.51 | U9.$18 11.32,51.3
  Top 0.406: U4.4 5.16,23.59 v4.88,23.88 | U4.PAD 2.93,25.12 1.97,26.09 1.97,26.34 v2,26.38
  other vias: 6.38,16.88 4.88,26.38 10,10.5 0.75,4 0.75,2.25 0.75,0.75 3.38,0.75 4.38,0.75 4.38,3 3.38,4 9.62,0.75 10.62,0.75 13.25,0.75 13.25,2.25 13.25,4 10.62,4 9.62,3 6.69,8.69 0.75,6 0.75,8.38 5,9 5,6 3,5.25 13.25,6 10.5,7.75 8,7.75 3,7 4,6 6.75,6 10.62,5.12 8.75,6 13.25,8 13.25,9.88 4,7.75 5,7.75 6.19,4.19 4.94,4.19 4.12,29.12 4.88,29.12 2.25,19.25 4.75,11.38 4,9 3,8.38 11.88,56.12 9.75,56.12 13,58.25 13,56.38 4,59 3.75,56.12 2.5,56.12 2.5,59 2.5,54.12 2.5,52.12 3.38,49.5 13,54.5 6,59 8,59 9.88,59 8.38,54.12 10.38,54.12 10.38,52.12 8.38,52.12 10.19,49.44 13,50.38 6.75,52.25 2,4 2,0.75 12,4 12,0.75 13.25,11.88 11.12,15.38 12.62,18.12 6.75,54.5 8,45.75 12.75,46.5 6.88,13.5 11.25,28.75 12.62,25 13,49.5 10,21.12 8.75,60 8.75,63 8.75,61.5 2.5,48 8,34 8,35.5 12.81,36.88 12.44,32 3.25,36.38 3.25,34.62 4.62,33.38 6,32.12 5.88,36.38 5.88,34.88 3.25,38.75 12.81,38.75 6.25,39.88 7.25,39.88
  pour Top (isolate 0.2): 0,64 9.25,64 9.25,59.5 14,59.5 14,0 9.38,0 9.38,3.88 4.62,3.88 4.62,0 0,0
  pour Bottom (isolate 0.2): 0,64 14,64 14,0 0,0
GOMI
  Top 0.15: U9.$33 8.38,55.44 7.88,55.94 6.75,55.94 4.12,53.31 4.12,48.33 U3.2_TXD1 | U1.2 8.88,21.12 8.12,21.88 8.12,27.38 7.38,28.12 7.38,29.5 5.62,31.25 4.5,31.25 2.25,33.5 2.25,46.25 2.62,46.62 3.75,46.62 4.12,47 4.12,47.2 4.4,47.48
  Top 0.2: U3.2_TXD1 4.4,47.48
GPS_ANT
  Top 0.2: U9.$27 10.78,57.33 U3.11_RF_IN
  Top 0.406: U3.11_RF_IN 11,59.24 ESD1.2
  Top 0.819: U3.11_RF_IN 11,61.5
  pour Top: 9.75,60 11.75,60 11.75,63.5 9.75,63.5
HF_ANT
  Top 0.8: C28.2 4,40.5 arc-90 6,42.5 | 6,42.5 12.75,42.5 6,42.5
HF_CLK
  Top 0.2: C27.1 6,33.5 U$55.18
INPT
  Top 0.2: C27.2 4.75,34.75 U44.3
INTR
  Top 0.2: U$55.8 9.5,37.5 R17.1
LED2
  Top 0.15: U1.17 5.88,15.38 5.62,15.12 4.38,15.12
  Top 0.2: 4.38,15.12 D2.C
MEM_CSN
  Top 0.152: U1.13 4.52,17.88 3.83,18.57 3.83,20.11 2.58,21.36 1.97,21.36 1.34,21.98 U4.1
MEM_MISO
  Top 0.152: U1.12 4.61,18.38 4.13,18.85 4.13,20.57 2.62,22.08 U4.2
MEM_MOSI
  Top 0.15: 6.08,26.94 6.25,26.78 6.25,21.25 6.38,21.12
  Top 0.152: U4.5 5.17,27.76 5.27,27.76 6.08,26.94 | U1.7 6.38,21.12
MEM_SCK
  Top 0.15: 5.78,26.69 5.88,26.6 U1.8
  Top 0.152: U4.6 3.88,27.82 4.56,27.15 5.32,27.15 5.78,26.69 | U1.8 5.88,20.91
MEM_WPN
  Top 0.152: U1.11 4.69,18.88 4.43,19.13 4.43,21.21 3.88,21.76 U4.3
N$2
  Top 0.15: U9.$7 U9.$6
N$3
  Top 0.15: U9.$17 10.78,50.59 R6.2
N$4
  Top 0.15: U9.$31 9.18,55.33 9,55.5 8.75,55.5 8,56.25 6.01,56.25 R4.1
N$5
  Top 0.15: U9.$16 10.38,50 10.62,49.75 10.74,49.75 R5.2
RADIO_VDD
  Top 0.152: U2.8 10.87,12.5 C7.1 10.87,11.38 10.88,11.38 10.88,11.49 10.99,11.5 U2.6
  Top 0.406: FB1.1 C7.1 10.99,11.5 C11.1 C21.1 10.99,9.62 | 10.99,9.62 C8.1 | L2.2 10.99,9.62
RADIO_XIN
  Top 0.152: U2.17 C13.2
RF_OUT
  Top 0.254: U2.4 8.38,10.12 8.88,9.62 L2.1 9.68,9.75
  Top 0.406: L2.1 9.62,9.69 C4.2
RTC_XI
  Top 0.2: U9.$12 8.78,50.9 8.56,50.69 8.06,50.69 7.81,50.44 | 7.81,50.44 7.58,50.2 Y1.1 | C22.1 7.8,50.45 7.81,50.44
RTC_XO
  Top 0.2: 8.93,50.19 Y1.2 9.18,50.44 9.18,50.5 | U9.$13 9.18,50.5 | C23.1 9.23,50.45 9.18,50.5
RXN
  Top 0.254: U2.3 L6.1
  Top 0.406: L7.2 7.88,8.76 | 7.88,8.76 L6.1 | 7.88,8.76 8.13,9.01 C5.1
RXP
  Top 0.254: U2.2 7.38,10.13 6.88,9.63 | 6.88,9.63 L6.2 | 6.88,9.63 L6.2
  Top 0.406: C6.2 6.86,9.63 L6.2
SAM_XOSC
  Top 0.15: U1.15 1.12,16.88 0.75,16.5 R9.2
  Top 0.2: 1.76,13.89 R10.1
  Top 0.4: C18.1 R10.1 0.88,13.88 R9.2
SCL  (via drill 0.3)
  Top 0.15: U1.6 6.88,21.12 6.62,21.38 6.62,26.88 5.88,27.62 5.88,29 5.12,29.75 3.38,29.75 v3.12,30 R2.1 | v1.62,31.5 0.75,32.38 0.75,59.88 1.25,60.38 1.25,60.62 0.38,61.5 0.38,62.41 U$51.P$8
  Top 0.2: U$55.12 v6.75,36.75
  Bottom 0.15: v3.12,30 v1.62,31.5 1.75,31.38 6.38,31.38 6.75,31.75 v6.75,36.75
SDA  (via drill 0.3)
  Top 0.15: U1.5 7.38,21.12 7,21.5 7,27 6.25,27.75 6.25,29.12 5.25,30.12 4.12,30.12 3.5,30.75 | 3.5,30.75 1.12,33.12 1.12,59.75 1.62,60.25 1.62,60.88 1.09,61.41 U$51.P$7 | R3.1 v3.12,30.75 3.5,30.75 | v7.5,31 U$55.19
  Bottom 0.15: v7.5,31 7.25,30.75 v3.12,30.75
SE_ON_OFF  (via drill 0.3)
  Top 0.15: v5.38,49.62 4.88,50.12 4.88,53 5.8,53.92 U9.$3 | U1.16 1.75,16.38 v1.62,16.25
  Bottom 0.15: v5.38,49.62 4.88,50.12 2.62,50.12 2.38,49.88 1.25,49.88 1,49.62 1,30.25 1.75,29.5 1.75,28.75 1,28 1,22.12 1.5,21.62 5.38,21.62 5.75,21.25 5.75,20.75 5.38,20.38 1.5,20.38 1,19.88 1,16.88 v1.62,16.25
SE_TCXO_CLK
  Top 0.15: U9.$21 11.72,52.73 11.88,52.88 11.88,53.52 U6.3
SE_VCO_TCXO
  Top 0.2: U9.$19 11.94,51.92 U6.4
  Top 0.4: C20.1 12.12,51.37 U6.4
SI_GPIO0
  Top 0.15: 10.42,13.83 9.88,14.38 9.88,16.38 U1.25
  Top 0.152: U2.9 10.19,13 10.42,13.24 10.42,13.83 | 10.17,16.33 U1.25
SI_GPIO1
  Top 0.15: U1.24 9.38,13.97 U2.10
  Top 0.152: 9.62,13.5 U2.10
SI_MISO
  Top 0.152: U1.21 U2.13
SI_MOSI
  Top 0.152: U1.20 U2.14
SI_NIRQ
  Top 0.152: U1.23 U2.11
SI_NSEL
  Top 0.152: U1.19 U2.15
SI_SCLK
  Top 0.152: U1.22 U2.12
SI_SDN  (via drill 0.3)
  Top 0.15: v4.12,13.88 5.62,13.88 6.38,14.62 U1.18
  Top 0.152: 6.88,10.72 U2.1 6.88,10.75 v5.88,10.75
  Bottom 0.152: v4.12,13.88 4.12,10.75 4.5,10.38 5.5,10.38 v5.88,10.75
SSC_DIS
  Top 0.2: U$55.5 11.25,35.5 11.5,35.75 11.62,35.75 11.74,35.75 R16.2
  Top 0.4: R16.2 12,36 12,36.74 R15.1
SWDCLK
  Top 0.15: U1.31 11.12,19.38 11.5,19.75 11.91,19.75 U$74.$5
SWDIO
  Top 0.15: U1.32 10.75,19.88 11,20.12 11,20.5 11.62,21.12 12.02,21.12 U$74.$4
TANK
  Top 0.406: C4.1 arc-90 9.01,6.88 L3.2
TCXO_OUT  (via drill 0.3)
  Top 0.2: C13.1 3.38,13 v3.38,15.75 | v8.25,30.25 9.38,31.38 12.62,31.38 13.12,31.88 13.12,33.01 C26.1
  Top 0.4: C18.2 C13.1
  Top 0.406: C13.1 3.87,12.38 U5.3
  Bottom 0.15: v3.38,15.75 3,15.75 1.38,17.38 1.38,19.62 1.75,20 5.5,20 6.25,20.75 6.25,21.25 5.5,22 1.62,22 1.38,22.25 1.38,27.88 2.88,29.38 3.5,29.38 4.38,30.25 v8.25,30.25
TCXO_VDD
  Top 0.4: FB2.1 C12.1 3.5,10.37 U5.4
TIMEPULSE  (via drill 0.3)
  Top 0.15: 7.03,53.52 U9.$4 5.9,53.52 5.25,52.88 5.25,50.88 v5.75,50.38 6.12,50 6.12,49.12 6.25,49 6.25,48.62 6.35,48.52 | U1.3 8.38,21.12 7.75,21.75 7.75,27.25 7,28 7,29.38 5.5,30.88 4.38,30.88 1.88,33.38 1.88,50.25 v2.12,50.5
  Top 0.2: 6.35,48.52 U3.4_TIMEPULSE 6.6,47.48
  Bottom 0.2: v2.12,50.5 5.62,50.5 v5.75,50.38
VBATT_SENSE
  Top 0.15: U1.14 3.38,17.38 R8.1 R7.2
VDD_CORE
  Top 0.2: U1.29 10.88,18.38 11.12,18.13 C16.1
VSOLAR
  Top 0.15: U1.4 7.88,21.12 7.38,21.62 7.38,27.12 6.62,27.88 6.62,29.25 5.38,30.5 4.25,30.5 1.5,33.25 1.5,59.62 3,61.12 3,62.5 U$51.P$6
WDI
  Top 0.15: U1.27 12.88,17.38 13.25,17.75 13.25,26.43 U7.4
WDI!RESET
  Top 0.2: U8.2 10,30.12 9.75,29.88 9.75,28.4 U7.1
XA
  Top 0.2: U$55.1 11.63,33.5 C26.2
XB
  Top 0.2: U$55.2 11.74,34 R13.1

### Text on the board
tPlace: CR2 | Lc | LR2 | LR1 | CM | CR1 | L0 | C0 | CM2 | FB / 15pF / 100nF / / 100pF | 2.2µF | LM
tStop: V0.98.0 | GPS | BRISTOL | UNIVERSITY | ARM / - / SWD
bStop: (C) Richard Meadows 2015